# Altium project remoteV1.3.1.PrjPcb
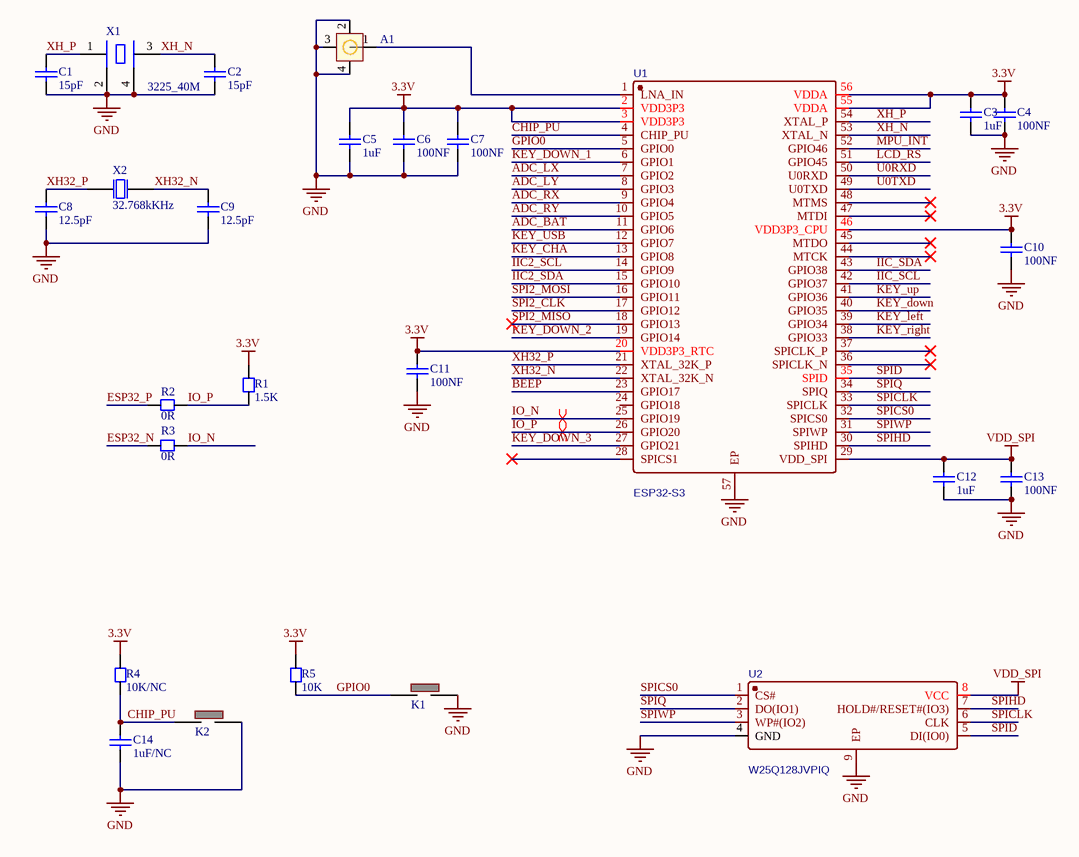
[diagram p0: Sheet0-mcu.SchDoc]
5 sheets, 195 parts. Net scope: global (net labels, ports and power ports of the same name join across sheets).
Board file: PCB.PcbDoc
Sheets:
  Sheet0-mcu.SchDoc
  Sheet1-control.SchDoc
  Sheet2-USB.SchDoc
  connect_board.SchDoc
  recv_board.SchDoc

## Sheet Sheet0-mcu.SchDoc
size A4; SheetNumber: 1; SheetTotal: 5

### Parts
A1  ANT-IPEX  [IPEX-SMD_HC-RF-IPEX0303-01]  (value not drawn)
C1  15pF  [CC1608-0603]
C2  15pF  [CC1608-0603]
C3  1uF  [CC1608-0603]
C4  100NF  [CC1608-0603]
C5  1uF  [CC1608-0603]
C6  100NF  [CC1608-0603]
C7  100NF  [CC1608-0603]
C8  12.5pF  [CC1608-0603]
C9  12.5pF  [CC1608-0603]
C10  100NF  [CC1608-0603]
C11  100NF  [CC1608-0603]
C12  1uF  [CC1608-0603]
C13  100NF  [CC1608-0603]
C14  1uF/NC  [CC1608-0603]
K1  KEY 3*4  [KEY 3*4]  (value not drawn)
K2  KEY 3*4  [KEY 3*4]  (value not drawn)
R1  1.5K  [CR1608-0603]
R2  0R  [CR1608-0603]
R3  0R  [CR1608-0603]
R4  10K/NC  [CR1608-0603]
R5  10K  [CR1608-0603]
U1  ESP32-S3  [QFN-56]
U2  W25Q128JVPIQ  [WSON-8]
X1  3225_40M  [XTAL-3225]
X2  32.768kKHz  [XTAL-3215]

### Nets
3.3V: C3.2 C4.2 C5.2 C6.2 C7.2 C10.2 C11.2 R1.1 R4.2 R5.2 U1.2(VDD3P3) U1.3(VDD3P3) U1.20(VDD3P3_RTC) U1.46(VDD3P3_CPU) U1.55(VDDA) U1.56(VDDA)
GND: A1.2 A1.3 A1.4 C1.1 C2.1 C3.1 C4.1 C5.1 C6.1 C7.1 C8.1 C9.1 C10.1 C11.1 C12.1 C13.1 C14.1 K1.2 K2.2 U1.57(EP) U2.4(GND) U2.9(EP) X1.2(GND) X1.4(GND)
VDD_SPI: C12.2 C13.2 U1.29(VDD_SPI) U2.8(VCC)
ADC_BAT: U1.11(GPIO6)
ADC_LX: U1.7(GPIO2)
ADC_LY: U1.8(GPIO3)
ADC_RX: U1.9(GPIO4)
ADC_RY: U1.10(GPIO5)
BEEP: U1.23(GPIO17)
CHIP_PU: C14.2 K2.1 R4.1 U1.4(CHIP_PU)
ESP32_N: R3.2
ESP32_P: R2.2
GPIO0: K1.1 R5.1 U1.5(GPIO0)
IIC2_SCL: U1.14(GPIO9)
IIC2_SDA: U1.15(GPIO10)
IIC_SCL: U1.42(GPIO37)
IIC_SDA: U1.43(GPIO38)
IO_N: R3.1 U1.25(GPIO19)
IO_P: R1.2 R2.1 U1.26(GPIO20)
KEY_CHA: U1.13(GPIO8)
KEY_down: U1.40(GPIO35)  [project net KEY_b]
KEY_DOWN_1: U1.6(GPIO1)
KEY_DOWN_2: U1.19(GPIO14)
KEY_DOWN_3: U1.27(GPIO21)
KEY_left: U1.39(GPIO34)
KEY_right: U1.38(GPIO33)  [project net KET_y]
KEY_up: U1.41(GPIO36)  [project net KEY_a]
KEY_USB: U1.12(GPIO7)
LCD_RS: U1.51(GPIO45)
MPU_INT: U1.52(GPIO46)
SPI2_CLK: U1.17(GPIO12)
SPI2_MISO: U1.18(GPIO13)
SPI2_MOSI: U1.16(GPIO11)
SPICLK: U1.33(SPICLK) U2.6(CLK)
SPICS0: U1.32(SPICS0) U2.1(CS#)
SPID: U1.35(SPID) U2.5(DI(IO0))
SPIHD: U1.30(SPIHD) U2.7(HOLD#/RESET#(IO3))
SPIQ: U1.34(SPIQ) U2.2(DO(IO1))
SPIWP: U1.31(SPIWP) U2.3(WP#(IO2))
U0RXD: U1.50(U0RXD)
U0TXD: U1.49(U0TXD)
XH32_N: C9.2 U1.22(XTAL_32K_N) X2.2(OSC2)
XH32_P: C8.2 U1.21(XTAL_32K_P) X2.1(OSC1)
XH_N: C2.2 U1.53(XTAL_N) X1.3(OSC2)
XH_P: C1.2 U1.54(XTAL_P) X1.1(OSC1)
NetA1_1: A1.1 U1.1(LNA_IN)

Not connected (* = marked no-connect by the designer): U1 24(GPIO18) 28(SPICS1)* 36(SPICLK_N)* 37(SPICLK_P)* 44(MTCK)* 45(MTDO)* 47(MTDI)* 48(MTMS)*

### Layout directives
differential pair: IO_N, IO_P

### Library data of the parts
A1 = ANT-IPEX: 贴片封装的天线 封装类型为IPEX
C1-C14 = Cap Chip 0603: 0603封装的电容; Published: 8-Jun-2000; Revision: July-2002: Re-released for DXP Platform.; Publisher: Altium Limited
K1 K2 = KEY 3*4: 轻触开关按键
R1-R5 = Resistor Chip 0603: 0603封装电阻; Published: 8-Jun-2000; Revision: July-2002: Re-released for DXP Platform.; Publisher: Altium Limited
U1 = ESP32-S3: Manufacturer: ESPRESSIF(乐鑫); Contributor: LCSC; Supplier: LCSC; Supplier Part: C2913192; Manufacturer Part: ESP32-S3; JLCPCB Part Class: Extended Part; spicePre: U; spiceSymbolName: ESP32-S3
U2 = W25Q128JVPIQ: Manufacturer: WINBOND(华邦); Contributor: LCSC; Supplier: LCSC; Supplier Part: C2803379; Manufacturer Part: W25Q128JVPIQ; JLCPCB Part Class: Extended Part; spicePre: U; spiceSymbolName: W25Q128JVPIQ
X1 = XTAL 3225: 3225封装的晶振
X2 = XTAL 3215 32.768kKHz: 3215封装的时钟晶振

## Sheet Sheet1-control.SchDoc
size A3; SheetNumber: 2; SheetTotal: 5
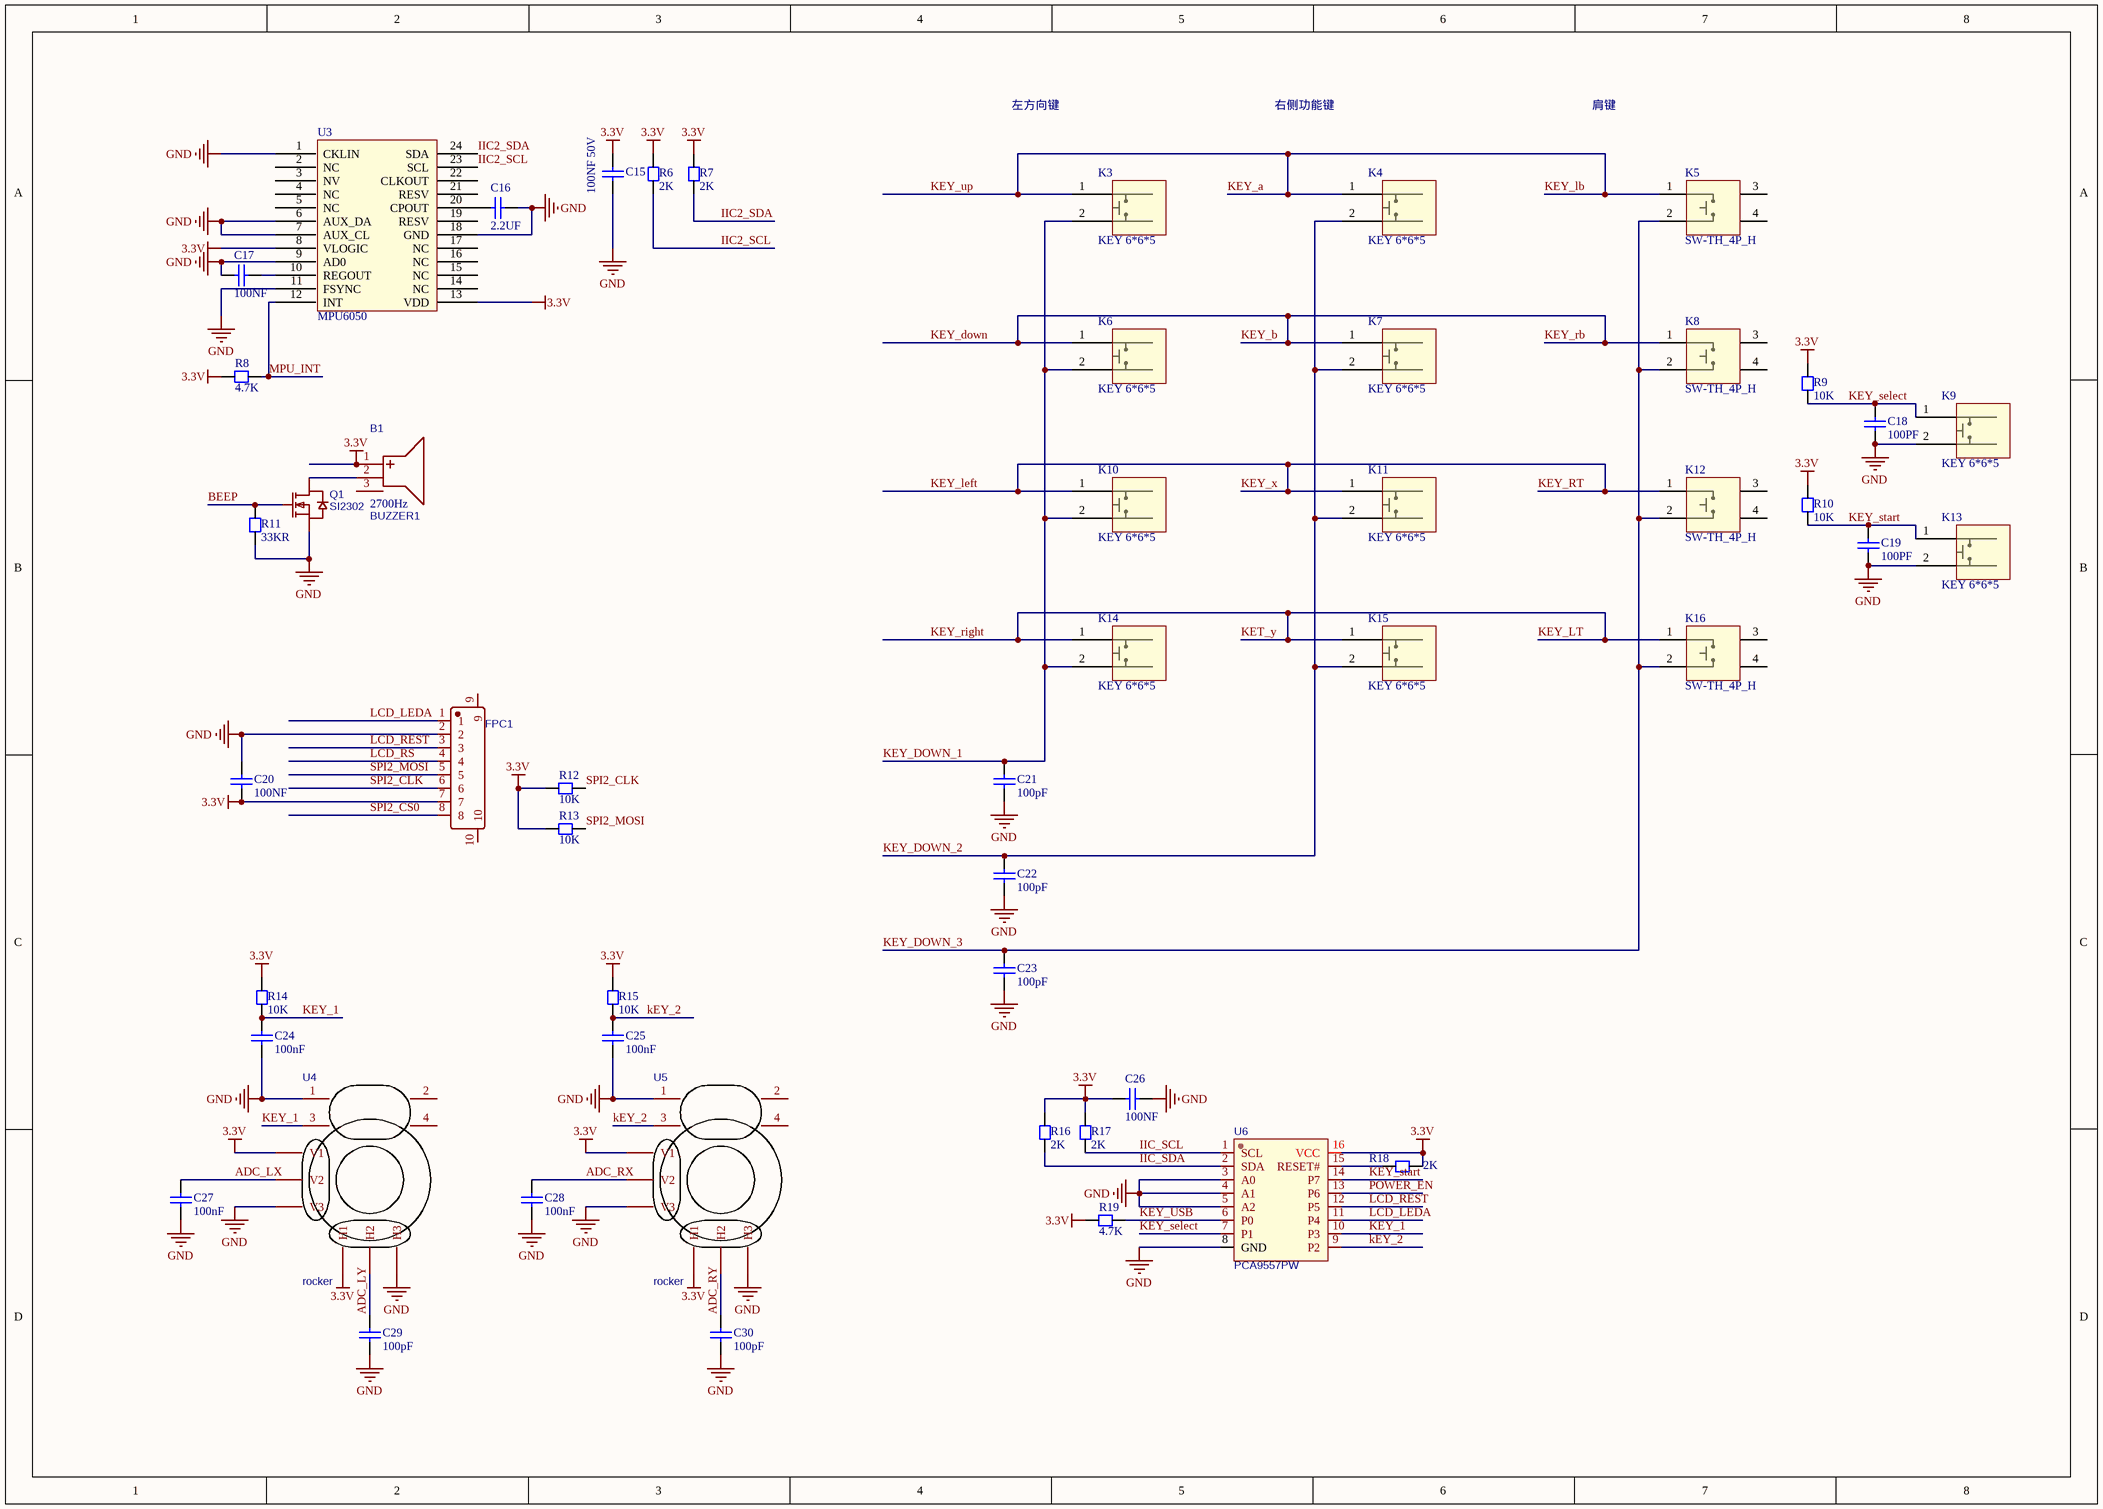
[diagram p1: Sheet1-control.SchDoc]

### Parts
B1  BUZZER1  [BUZ-SMD_GSC7525RA]
C15  100NF 50V  [CC1608-0603]
C16  2.2UF  [CC1608-0603]
C17  100NF  [CC1608-0603]
C18  100PF  [CC1608-0603]
C19  100PF  [CC1608-0603]
C20  100NF  [CC1608-0603]
C21  100pF  [CC1608-0603]
C22  100pF  [CC1608-0603]
C23  100pF  [CC1608-0603]
C24  100nF  [CC1608-0603]
C25  100nF  [CC1608-0603]
C26  100NF  [CC1608-0603]
C27  100nF  [CC1608-0603]
C28  100nF  [CC1608-0603]
C29  100pF  [CC1608-0603]
C30  100pF  [CC1608-0603]
FPC1  FFC 05 8P  [FFC-SMD_8P-P0.50]  (value not drawn)
K3  KEY 6*6*5  [KEY 6*6*5]
K4  KEY 6*6*5  [KEY 6*6*5]
K5  SW-TH_4P_H  [SW-TH_KH-6X6X7H-ZJ]
K6  KEY 6*6*5  [KEY 6*6*5]
K7  KEY 6*6*5  [KEY 6*6*5]
K8  SW-TH_4P_H  [SW-TH_KH-6X6X7H-ZJ]
K9  KEY 6*6*5  [KEY 6*6*5]
K10  KEY 6*6*5  [KEY 6*6*5]
K11  KEY 6*6*5  [KEY 6*6*5]
K12  SW-TH_4P_H  [SW-TH_KH-6X6X7H-ZJ]
K13  KEY 6*6*5  [KEY 6*6*5]
K14  KEY 6*6*5  [KEY 6*6*5]
K15  KEY 6*6*5  [KEY 6*6*5]
K16  SW-TH_4P_H  [SW-TH_KH-6X6X7H-ZJ]
Q1  SI2302  [SOT-23]
R6  2K  [CR1608-0603]
R7  2K  [CR1608-0603]
R8  4.7K  [CR1608-0603]
R9  10K  [CR1608-0603]
R10  10K  [CR1608-0603]
R11  33KR  [CR1608-0603]
R12  10K  [CR1608-0603]
R13  10K  [CR1608-0603]
R14  10K  [CR1608-0603]
R15  10K  [CR1608-0603]
R16  2K  [CR1608-0603]
R17  2K  [CR1608-0603]
R18  2K  [CR1608-0603]
R19  4.7K  [CR1608-0603]
U3  MPU6050  [QFN24 - duplicate]
U4  rocker  [PCBComponent_1]
U5  rocker  [PCBComponent_1]
U6  PCA9557PW  [TSSOP-16]

### Nets
3.3V: B1.1(+) C15.2 C20.1 C26.2 FPC1.7 R6.1 R7.1 R8.1 R9.1 R10.1 R12.2 R13.2 R14.2 R15.2 R16.1 R17.1 R18.1 R19.1 U3.8(VLOGIC) U3.13(VDD) U4.5(V1) U4.8(H1) U5.5(V1) U5.8(H1) U6.16(VCC)
GND: C15.1 C16.2 C17.1 C18.2 C19.2 C20.2 C21.1 C22.1 C23.1 C24.1 C25.1 C26.1 C27.1 C28.1 C29.1 C30.1 FPC1.2 K9.2 K13.2 Q1.2(S) R11.2 U3.1(CKLIN) U3.6(AUX_DA) U3.7(AUX_CL) U3.9(AD0) U3.11(FSYNC) U3.18(GND) U4.1 U4.7(V3) U4.10(H3) U5.1 U5.7(V3) U5.10(H3) U6.3(A0) U6.4(A1) U6.5(A2) U6.8(GND)
ADC_LX: C27.2 U4.6(V2)
ADC_LY: C29.2 U4.9(H2)
ADC_RX: C28.2 U5.6(V2)
ADC_RY: C30.2 U5.9(H2)
BEEP: Q1.1(G) R11.1
IIC2_SCL: R6.2 U3.23(SCL)
IIC2_SDA: R7.2 U3.24(SDA)
IIC_SCL: R17.2 U6.1(SCL)
IIC_SDA: R16.2 U6.2(SDA)
KET_y: K14.1 K15.1 K16.1  [also labelled KEY_LT, KEY_right]
KEY_1: C24.2 R14.1 U4.3 U6.10(P3)
kEY_2: C25.2 R15.1 U5.3 U6.9(P2)
KEY_a: K3.1 K4.1 K5.1  [also labelled KEY_lb, KEY_up]
KEY_b: K6.1 K7.1 K8.1  [also labelled KEY_down, KEY_rb]
KEY_DOWN_1: C21.2 K3.2 K6.2 K10.2 K14.2
KEY_DOWN_2: C22.2 K4.2 K7.2 K11.2 K15.2
KEY_DOWN_3: C23.2 K5.2 K8.2 K12.2 K16.2
KEY_left: K10.1 K11.1 K12.1  [also labelled KEY_RT, KEY_x]
KEY_select: C18.1 K9.1 R9.2 U6.7(P1)
KEY_start: C19.1 K13.1 R10.2 U6.14(P7)
KEY_USB: R19.2 U6.6(P0)
LCD_LEDA: FPC1.1 U6.11(P4)
LCD_REST: FPC1.3 U6.12(P5)
LCD_RS: FPC1.4
MPU_INT: R8.2 U3.12(INT)
POWER_EN: U6.13(P6)
SPI2_CLK: FPC1.6 R12.1
SPI2_CS0: FPC1.8
SPI2_MOSI: FPC1.5 R13.1
NetB1_2: B1.2(-) Q1.3(D)
NetC16_1: C16.1 U3.20(CPOUT)
NetC17_2: C17.2 U3.10(REGOUT)
NetR18_2: R18.2 U6.15(RESET#)

Not connected (* = marked no-connect by the designer): B1 3(EH); FPC1 9 10; K5 3 4; K8 3 4; K12 3 4; K16 3 4; U3 2(NC) 3(NV) 4(NC) 5(NC) 14(NC) 15(NC) 16(NC) 17(NC) 19(RESV) 21(RESV) 22(CLKOUT); U4 2 4; U5 2 4

### Notes on the sheet
- 左方向键
- 右侧功能键
- 肩键

### Library data of the parts
B1 = BUZZER1: 2700Hz; Manufacturer: INGHAi(赢海); Manufacturer Part: GSC7525RA-16R2700; Contributor: LCSC; nameAlias: Value; Supplier: LCSC; Supplier Part: C255313; spicePre: B; spiceSymbolName: GSC7525RA-16R2700
C15-C30 = Cap Chip 0603: 0603封装的电容; Published: 8-Jun-2000; Revision: July-2002: Re-released for DXP Platform.; Publisher: Altium Limited
FPC1 = FFC 05 8P: Manufacturer: TXGA(特思嘉); Manufacturer Part: FFC05001-08SBB124W5M-H; Contributor: LCSC; Supplier: LCSC; Supplier Part: C456420; JLCPCB Part Class: Extended Part; spicePre: F; spiceSymbolName: FFC05001-08SBB124W5M-H
K3 K4 K6 K7 K9-K11 K13-K15 = KEY 6*6*5: 无声轻触开关
K5 K8 K12 K16 = SW-TH_4P_H: 卧式轻触开关
Q1 = SI2302: N沟道 / 漏源电压(Vdss) 20V / 连续漏极电流(Id) 2.8A / 功率(Pd) 900mW / 导通电阻(RDS(on)@Vgs,Id) 55mΩ@4.5V,2.8A / 阈值电压(Vgs(th)@Id) 1.2V@250uA / 输入电容(Ciss@Vds) 260pF@10V; Manufacturer: TWGMC(台湾迪嘉); Manufacturer Part: SI2306; Contributor: LCSC; Supplier: LCSC; Supplier Part: C727154; JLCPCB Part Class: Extended Part; spicePre: Q; spiceSymbolName: SI2306_C727154
R6-R10 R12-R19 = Resistor Chip 0603: 0603封装电阻; Published: 8-Jun-2000; Revision: July-2002: Re-released for DXP Platform.; Publisher: Altium Limited
R11 = Chip resistor: 贴片电阻
U3 = MPU6050: 陀螺仪
U4 U5 = rocker: Manufacturer Part: 摇杆; Contributor: Alex_Ai; spicePre: U; spiceSymbolName: 摇杆_直插_圆半径13_10电气脚_4固定脚 COPY
U6 = PCA9557PW: TSSOP-16 8位I2C总线和SMBus I/O扩展器芯片; Manufacturer: TI(德州仪器); Contributor: LCSC; Supplier: LCSC; Supplier Part: C1542488; Manufacturer Part: PCA9557PW; JLCPCB Part Class: Extended Part; spicePre: U; spiceSymbolName: PCA9557PW

## Sheet Sheet2-USB.SchDoc
size A3; SheetNumber: 3; SheetTotal: 5
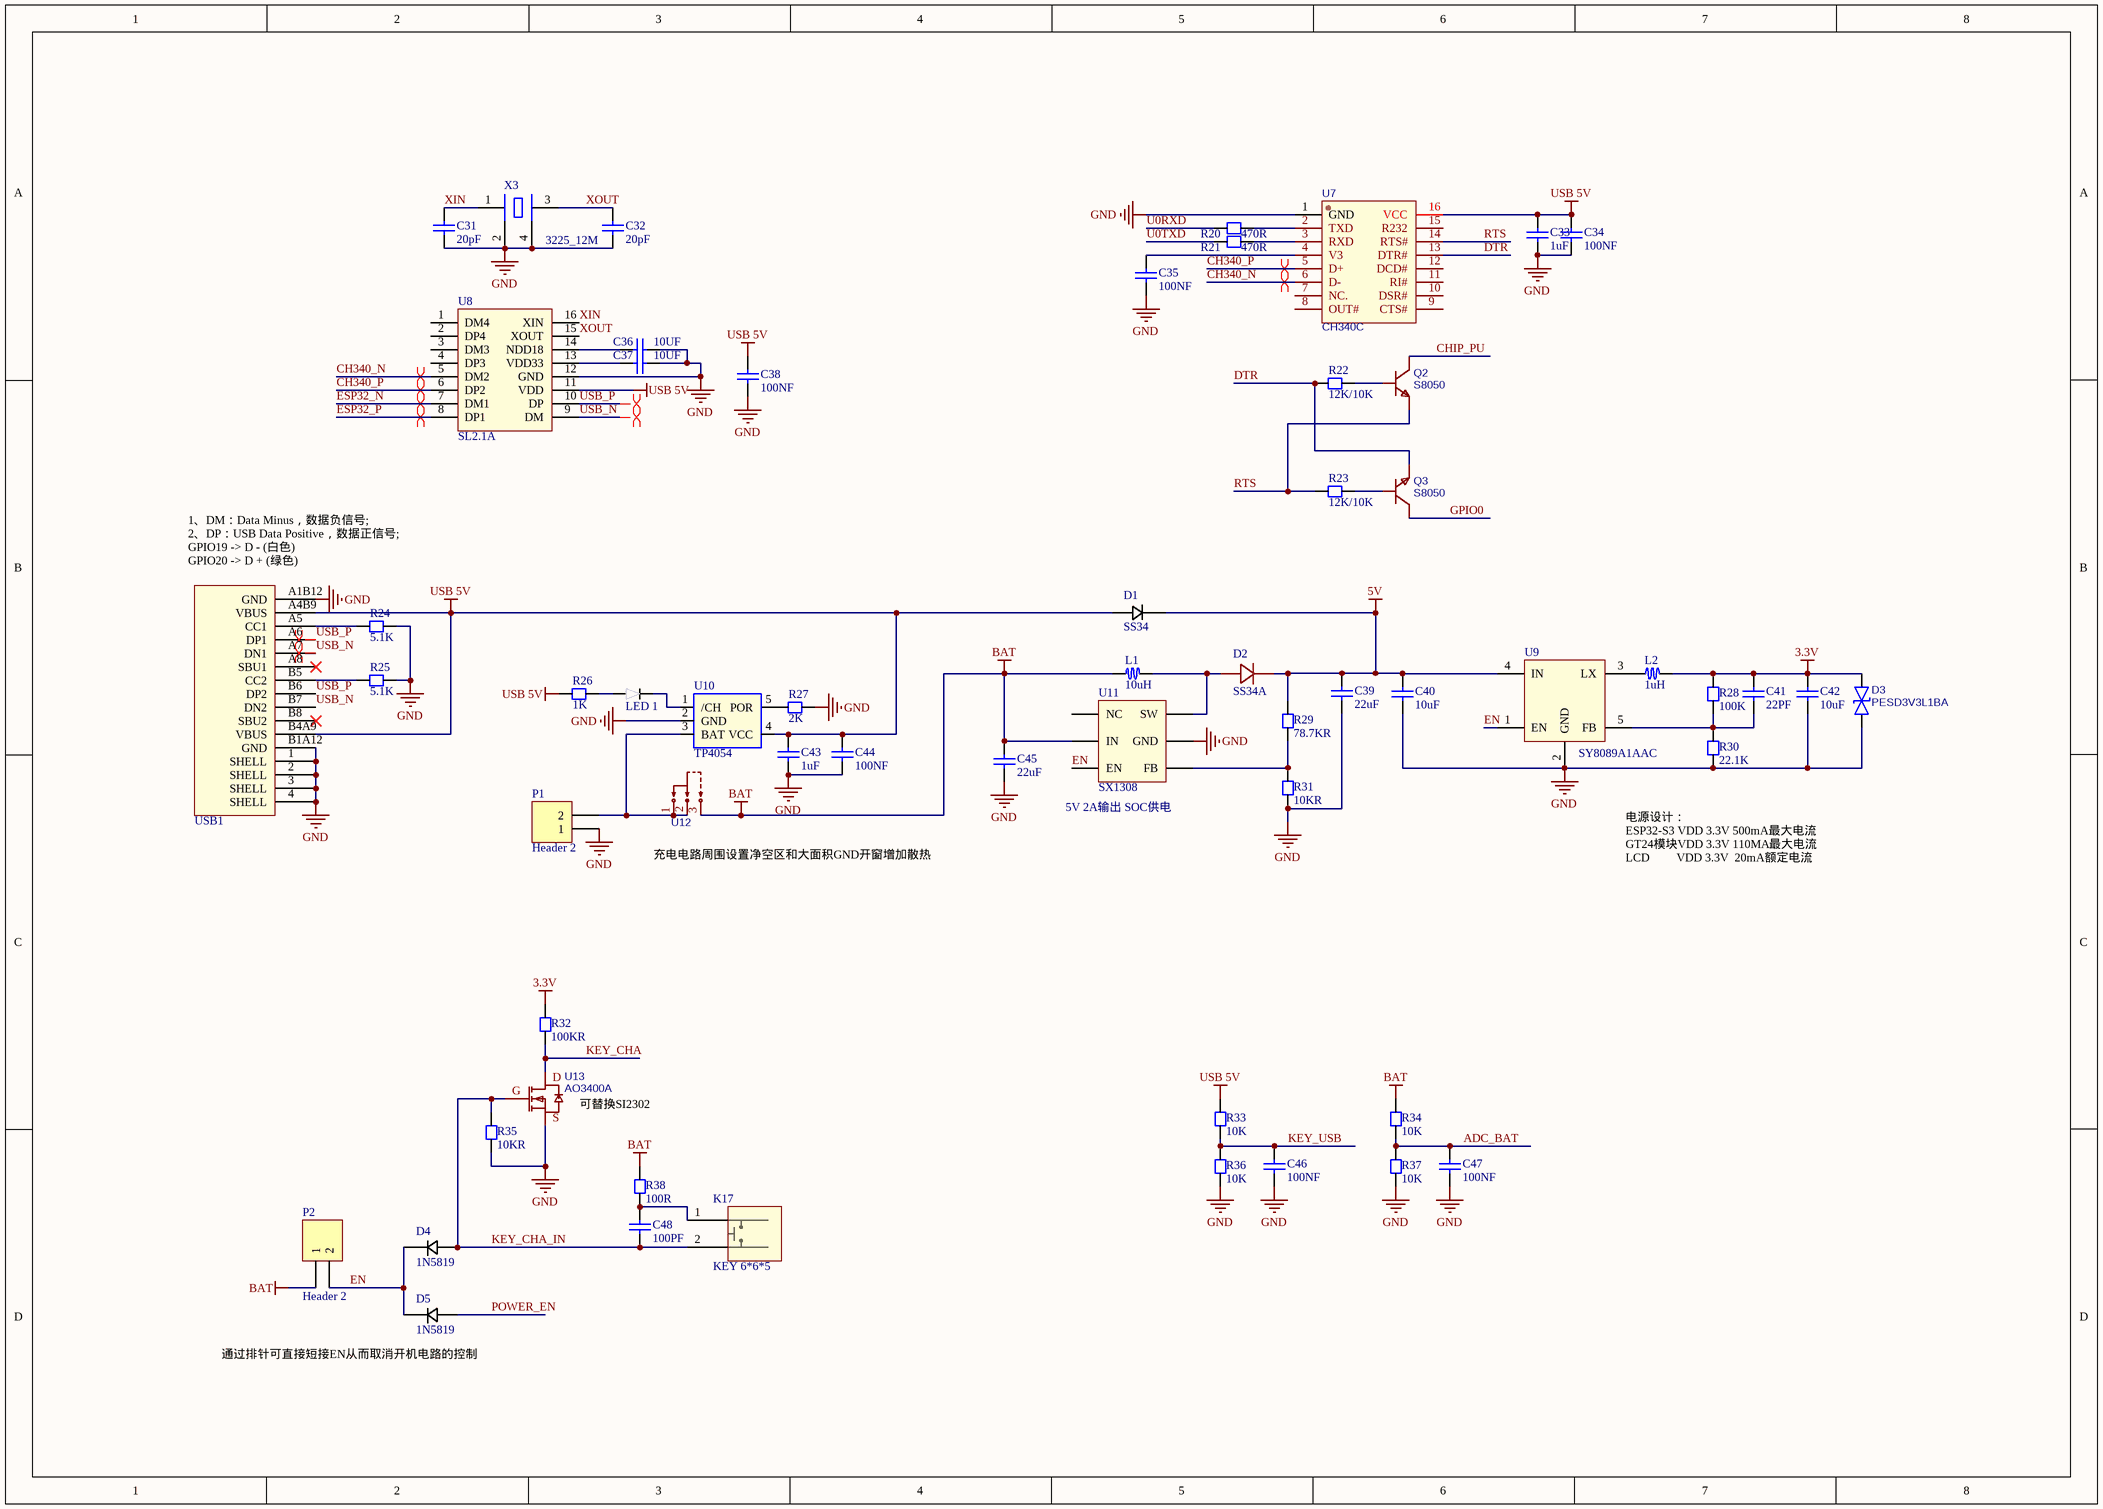
[diagram p2: Sheet2-USB.SchDoc]

### Parts
C31  20pF  [CC1608-0603]
C32  20pF  [CC1608-0603]
C33  1uF  [CC1608-0603]
C34  100NF  [CC1608-0603]
C35  100NF  [CC1608-0603]
C36  10UF  [CC1608-0603]
C37  10UF  [CC1608-0603]
C38  100NF  [CC1608-0603]
C39  22uF  [CC1608-0603]
C40  10uF  [CC1608-0603]
C41  22PF  [CC1608-0603]
C42  10uF  [CC1608-0603]
C43  1uF  [CC1608-0603]
C44  100NF  [CC1608-0603]
C45  22uF  [CC1608-0603]
C46  100NF  [CC1608-0603]
C47  100NF  [CC1608-0603]
C48  100PF  [CC1608-0603]
D1  SS34  [DO-214 AA]
D2  SS34A  [DO-214 AA SMB]
D3  PESD3V3L1BA  [SOD-323]
D4  1N5819  [SOD-323_L1.8-W1.3-LS2.5-RD]
D5  1N5819  [SOD-323_L1.8-W1.3-LS2.5-RD]
K17  KEY 6*6*5  [KEY 6*6*5]
L1  10uH  [Inductor-6045]
L2  1uH  [Inductor-4018]
LED_1  LED 0603  [LED 0603]  (value not drawn)
P1  Header 2  [HX2.54-2]
P2  Header 2  [HDR1X2]
Q2  S8050  [SOT-23]
Q3  S8050  [SOT-23]
R20  470R  [CR1608-0603]
R21  470R  [CR1608-0603]
R22  12K/10K  [CR1608-0603]
R23  12K/10K  [CR1608-0603]
R24  5.1K  [CR1608-0603]
R25  5.1K  [CR1608-0603]
R26  1K  [CR1608-0603]
R27  2K  [CR1608-0603]
R28  100K  [CR1608-0603]
R29  78.7KR  [CR1608-0603]
R30  22.1K  [CR1608-0603]
R31  10KR  [CR1608-0603]
R32  100KR  [CR1608-0603]
R33  10K  [CR1608-0603]
R34  10K  [CR1608-0603]
R35  10KR  [CR1608-0603]
R36  10K  [CR1608-0603]
R37  10K  [CR1608-0603]
R38  100R  [CR1608-0603]
U7  CH340C  [SOP-16]
U8  SL2.1A  [SOP-16]
U9  SY8089A1AAC  [SOT23-5]
U10  TP4054  [SOT23-5]
U11  SX1308  [SOT23-6]
U12  HX SS12D10G4  [SW-TH_3P-SS12D06]  (value not drawn)
U13  AO3400A  [SOT-23]
USB1  Tpye-c 16P  [TYPE-C 16P]  (value not drawn)
X3  3225_12M  [XTAL-3225]

### Nets
3.3V: C41.2 C42.2 D3.1 L2.2 R28.1 R32.2
5V: C39.1 C40.2 D1.1(K) D2.1(C) R29.2 U9.4(IN)
BAT: C45.2 L1.1 P2.1 R34.2 R38.1 U11.5(IN) U12.3
GND: C31.1 C32.1 C33.1 C34.1 C35.1 C36.1 C37.1 C38.1 C39.2 C40.1 C42.1 C43.1 C44.1 C45.1 C46.1 C47.1 D3.2 P1.1 R24.1 R25.1 R27.2 R30.2 R31.1 R35.1 R36.1 R37.1 U7.1(GND) U8.12(GND) U9.2(GND) U10.2(GND) U11.2(GND) U13.2(S) USB1.1(SHELL) USB1.2(SHELL) USB1.3(SHELL) USB1.4(SHELL) USB1.A1B12(GND) USB1.B1A12(GND) X3.2(GND) X3.4(GND)
USB 5V: C33.2 C34.2 C38.2 C43.2 C44.2 D1.2(A) R26.1 R33.2 U7.16(VCC) U8.11(VDD) U10.4(VCC) USB1.A4B9(VBUS) USB1.B4A9(VBUS)
ADC_BAT: C47.2 R34.1 R37.2
CH340_N: U7.6(D-) U8.5(DM2)
CH340_P: U7.5(D+) U8.6(DP2)
CHIP_PU: Q2.3(C)
DTR: Q3.2(E) R22.1 U7.13(DTR#)
EN: D4.1 D5.1 P2.2 U9.1(EN) U11.4(EN)
ESP32_N: U8.7(DM1)
ESP32_P: U8.8(DP1)
GPIO0: Q3.3(C)
KEY_CHA: R32.1 U13.3(D)
KEY_CHA_IN: C48.2 D4.2 K17.2 R35.2 U13.1(G)
KEY_USB: C46.2 R33.1 R36.2
POWER_EN: D5.2
RTS: Q2.2(E) R23.1 U7.14(RTS#)
U0RXD: R20.2
U0TXD: R21.2
USB_N: U8.9(DM) USB1.A7(DN1) USB1.B7(DN2)
USB_P: U8.10(DP) USB1.A6(DP1) USB1.B6(DP2)
XIN: C31.2 U8.16(XIN) X3.1(OSC1)
XOUT: C32.2 U8.15(XOUT) X3.3(OSC2)
NetC35_2: C35.2 U7.4(V3)
NetC36_2: C36.2 U8.14(NDD18)
NetC37_2: C37.2 U8.13(VDD33)
NetC41_1: C41.1 R28.2 R30.1 U9.5(FB)
NetC48_1: C48.1 K17.1 R38.2
NetD2_2: D2.2(A) L1.2 U11.1(SW)
NetL2_1: L2.1 U9.3(LX)
NetLED_1_1: LED_1.1 R26.2
NetLED_1_2: LED_1.2 U10.1(/CH)
NetP1_2: P1.2 U10.3(BAT) U12.1 U12.2
NetQ2_1: Q2.1(B) R22.2
NetQ3_1: Q3.1(B) R23.2
NetR20_1: R20.1 U7.2(TXD)
NetR21_1: R21.1 U7.3(RXD)
NetR24_2: R24.2 USB1.A5(CC1)
NetR25_2: R25.2 USB1.B5(CC2)
NetR27_1: R27.1 U10.5(POR)
NetR29_1: R29.1 R31.2 U11.3(FB)

Not connected (* = marked no-connect by the designer): U7 7(NC.) 8(OUT#) 9(CTS#) 10(DSR#) 11(RI#) 12(DCD#) 15(R232); U8 1(DM4) 2(DP4) 3(DM3) 4(DP3); U11 6(NC); USB1 A8(SBU1)* B8(SBU2)*

### Layout directives
differential pair: CH340_N, CH340_P, ESP32_N, ESP32_P, USB_N, USB_P

### Notes on the sheet
- (near USB1) 1、DM：Data Minus，数据负信号;
  2、DP：USB Data Positive，数据正信号;
  GPIO19 -> D - (白色)
  GPIO20 -> D + (绿色)
- (near U12) 充电电路周围设置净空区和大面积GND开窗增加散热
- (near U11) 5V 2A输出 SOC供电
- 电源设计：
  ESP32-S3 VDD 3.3V 500mA最大电流
  GT24模块VDD 3.3V 110MA最大电流
  LCD         VDD 3.3V  20mA额定电流
- (near U13) 可替换SI2302
- 通过排针可直接短接EN从而取消开机电路的控制

### Library data of the parts
C31-C38 C40-C48 = Cap Chip 0603: 0603封装的电容; Published: 8-Jun-2000; Revision: July-2002: Re-released for DXP Platform.; Publisher: Altium Limited
C39 = Chip capacitor: 贴片电容
D1 = SS34: 肖特基二极管
D2 = SS34A: 大电流肖特基二极管，5A/40V
D3 = PESD3V3L1BA: SOD-323 3.3V 双向ESD防静电二极管保护芯片; Manufacturer: MDD; Manufacturer Part: SMAJ6.5CA; Supplier: LCSC; Supplier Part: C110041; JLCPCB Part Class: Extended Part; spicePre: D; spiceSymbolName: SMAJ6.5CA-C110041
D4 D5 = 1N5819: 肖特基二极管
K17 = KEY 6*6*5: 无声轻触开关
L1 = Inductor-6045: 6045封装 线绕SMD功率电感
L2 = Inductor-4018: 贴片电感 1206封装
P1 P2 = Header 2: Header, 2-Pin; LatestRevisionDate: 17-Jul-2002; LatestRevisionNote: Re-released for DXP Platform.; Publisher: Altium Limited
Q2 Q3 = S8050: Manufacturer: SALLTECH(萨瑞); Contributor: lcsc; Supplier: LCSC; Supplier Part: C3027096; Manufacturer Part: S8050; spicePre: Q; spiceSymbolName: S8050_C3027096
R20-R28 R30 R33 R34 R36-R38 = Resistor Chip 0603: 0603封装电阻; Published: 8-Jun-2000; Revision: July-2002: Re-released for DXP Platform.; Publisher: Altium Limited
R29 R31 R32 R35 = Chip resistor: 贴片电阻
U7 = CH340C: Manufacturer: WCH(南京沁恒); Supplier: LCSC; Manufacturer Part: CH340C; Supplier Part: C84681; JLCPCB Part Class: Extended Part; spicePre: U; spiceSymbolName: CH340C
U8 = SL2.1A: USB HUB 四拓展
U9 = SY8089A1AAC: SY8089A1是一种高效率的1.5MHz同步降压DC/DC稳压器，能够提供高达输出电流2A。它可以在2.5V到5.5V的宽输入电压范围内工作，集成了主开关和同步开关，具有极低的RDS(ON)，最大限度地减少了导通损耗。 / 输出电压纹波小，外接电感小，电容器尺寸小 / 1.5MHz开关频率。
U10 = TP4054: 迷你充电IC SOT-23-5
U11 = SX1308: SOT23-6 升压芯片
U12 = SW-TH_3P-SS12D06: BOM_Manufacturer: hanxia(韩下); Contributor: lcsc; BOM_Supplier: LCSC; BOM_Supplier Part: C5149841; BOM_Manufacturer Part: HX SS12D10G4; link: https://atta.szlcsc.com/upload/public/pdf/source/20220907/2020D7183ED16DD6E2B9F5A13FB144CF.pdf; BOM_JLCPCB Part Class: Extended Part; spicePre: U; spiceSymbolName: HX SS12D10G4
U13 = AO3400A: UMW AO3400A SOT-23 30V/5.8A N沟道 MOS(场效应管)芯片; Manufacturer: ElecSuper(静芯微）; Manufacturer Part: AO3401A; Contributor: lcsc; Supplier: LCSC; Supplier Part: C5224202; JLCPCB Part Class: Extended Part; link: https://so.szlcsc.com/global.html?k=C5224202&ref=editor; spicePre: U; spiceSymbolName: AO3401A_C5224202
USB1 = Tpye-c 16P: 16P 封装的TYPE -c接口 4固定插脚 双向
X3 = XTAL 3225: 3225封装的晶振

## Sheet connect_board.SchDoc
size A3; SheetNumber: 4; SheetTotal: 5
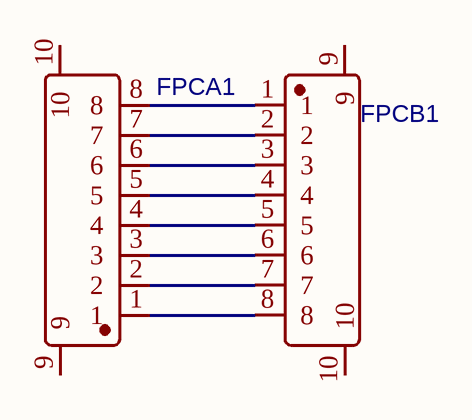
[diagram p3: connect_board.SchDoc]

### Parts
FPCA1  FFC 05 8P  [FFC-SMD_8P-P0.50]  (value not drawn)
FPCB1  FFC 05 8P  [FFC-SMD_8P-P0.50]  (value not drawn)

### Nets
NetFPCA1_1: FPCA1.1 FPCB1.8
NetFPCA1_2: FPCA1.2 FPCB1.7
NetFPCA1_3: FPCA1.3 FPCB1.6
NetFPCA1_4: FPCA1.4 FPCB1.5
NetFPCA1_5: FPCA1.5 FPCB1.4
NetFPCA1_6: FPCA1.6 FPCB1.3
NetFPCA1_7: FPCA1.7 FPCB1.2
NetFPCA1_8: FPCA1.8 FPCB1.1

Not connected (* = marked no-connect by the designer): FPCA1 9 10; FPCB1 9 10

### Library data of the parts
FPCA1 FPCB1 = FFC 05 8P: as FPC1 on sheet Sheet1-control; Supplier: LCSC; Supplier Part: C456420; JLCPCB Part Class: Extended Part; spicePre: F; spiceSymbolName: FFC05001-08SBB124W5M-H

## Sheet recv_board.SchDoc
size A3; SheetNumber: 5; SheetTotal: 5
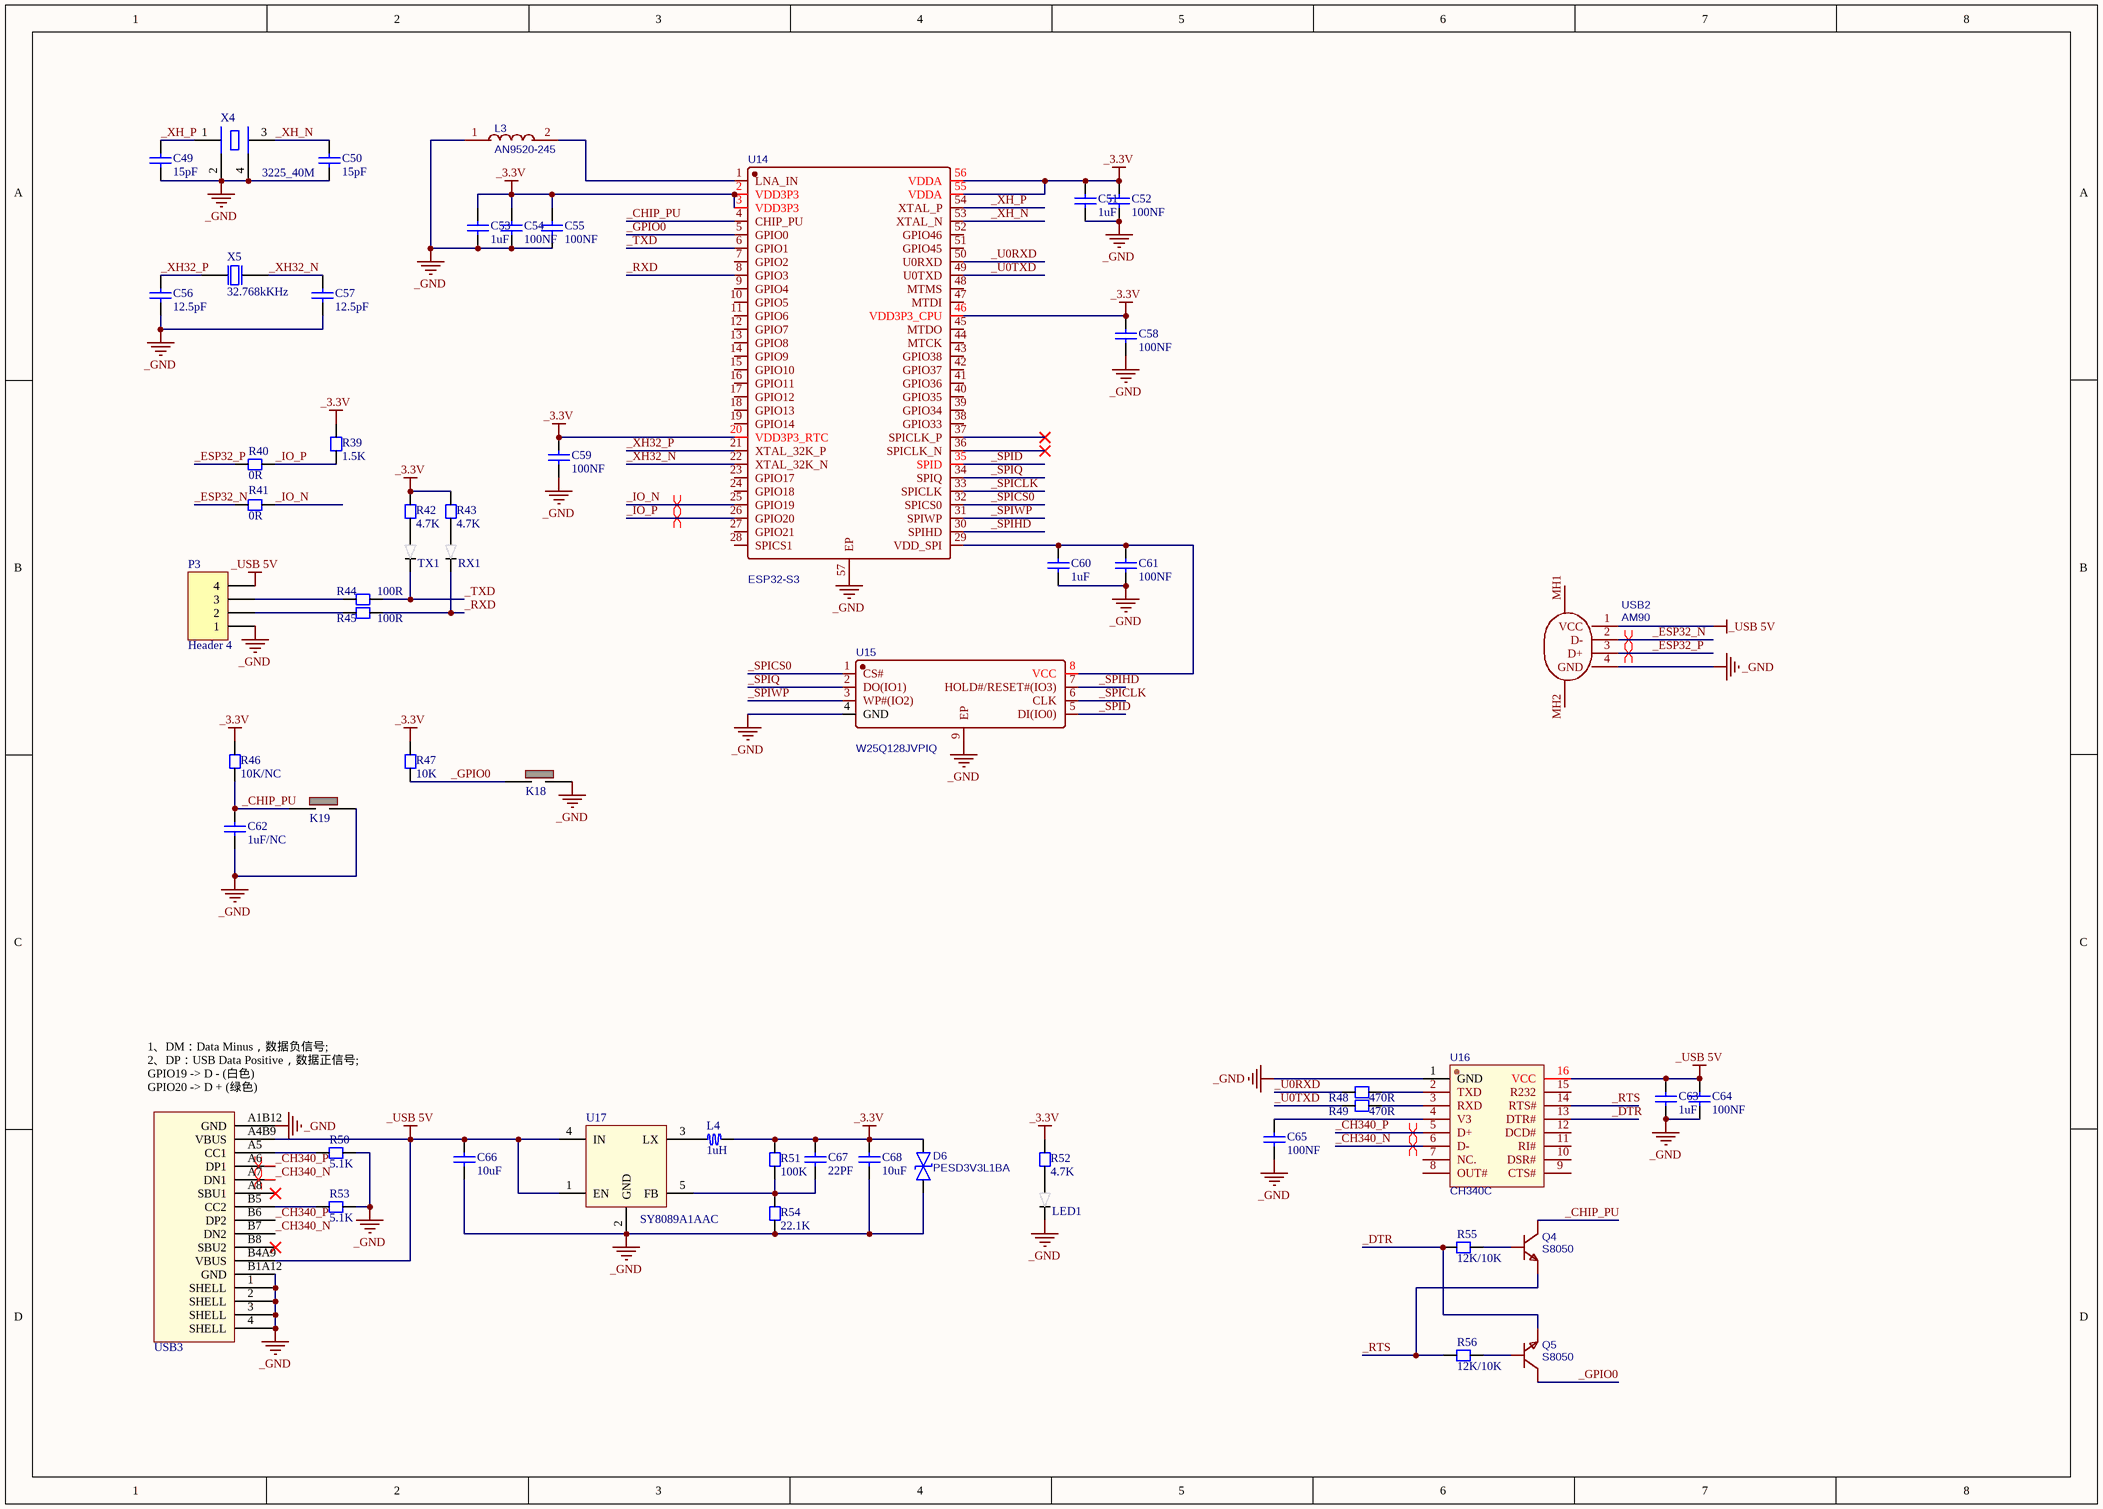
[diagram p4: recv_board.SchDoc]

### Parts
C49  15pF  [CC1608-0603]
C50  15pF  [CC1608-0603]
C51  1uF  [CC1608-0603]
C52  100NF  [CC1608-0603]
C53  1uF  [CC1608-0603]
C54  100NF  [CC1608-0603]
C55  100NF  [CC1608-0603]
C56  12.5pF  [CC1608-0603]
C57  12.5pF  [CC1608-0603]
C58  100NF  [CC1608-0603]
C59  100NF  [CC1608-0603]
C60  1uF  [CC1608-0603]
C61  100NF  [CC1608-0603]
C62  1uF/NC  [CC1608-0603]
C63  1uF  [CC1608-0603]
C64  100NF  [CC1608-0603]
C65  100NF  [CC1608-0603]
C66  10uF  [CC1608-0603]
C67  22PF  [CC1608-0603]
C68  10uF  [CC1608-0603]
D6  PESD3V3L1BA  [SOD-323]
K18  KEY 3*4  [KEY 3*4]  (value not drawn)
K19  KEY 3*4  [KEY 3*4]  (value not drawn)
L3  AN9520-245  [ANT-SMD_L9.5-W2.1]
L4  1uH  [Inductor-4018]
LED1  LED 0603  [LED 0603]  (value not drawn)
P3  Header 4  [HDR1X4]
Q4  S8050  [SOT-23]
Q5  S8050  [SOT-23]
R39  1.5K  [CR1608-0603]
R40  0R  [CR1608-0603]
R41  0R  [CR1608-0603]
R42  4.7K  [CR1608-0603]
R43  4.7K  [CR1608-0603]
R44  100R  [CR1608-0603]
R45  100R  [CR1608-0603]
R46  10K/NC  [CR1608-0603]
R47  10K  [CR1608-0603]
R48  470R  [CR1608-0603]
R49  470R  [CR1608-0603]
R50  5.1K  [CR1608-0603]
R51  100K  [CR1608-0603]
R52  4.7K  [CR1608-0603]
R53  5.1K  [CR1608-0603]
R54  22.1K  [CR1608-0603]
R55  12K/10K  [CR1608-0603]
R56  12K/10K  [CR1608-0603]
RX1  LED 0603  [LED 0603]  (value not drawn)
TX1  LED 0603  [LED 0603]  (value not drawn)
U14  ESP32-S3  [QFN-56]
U15  W25Q128JVPIQ  [WSON-8]
U16  CH340C  [SOP-16]
U17  SY8089A1AAC  [SOT23-5]
USB2  AM90  [USB-AM]
USB3  Tpye-c 16P  [TYPE-C 16P]  (value not drawn)
X4  3225_40M  [XTAL-3225]
X5  32.768kKHz  [XTAL-3215]

### Nets
_3.3V: C51.2 C52.2 C53.2 C54.2 C55.2 C58.2 C59.2 C67.2 C68.2 D6.1 L4.2 R39.1 R42.1 R43.1 R46.2 R47.2 R51.1 R52.1 U14.2(VDD3P3) U14.3(VDD3P3) U14.20(VDD3P3_RTC) U14.46(VDD3P3_CPU) U14.55(VDDA) U14.56(VDDA)
_GND: C49.1 C50.1 C51.1 C52.1 C53.1 C54.1 C55.1 C56.1 C57.1 C58.1 C59.1 C60.1 C61.1 C62.1 C63.1 C64.1 C65.1 C66.1 C68.1 D6.2 K18.2 K19.2 L3.1 LED1.2 P3.1 R50.1 R53.1 R54.2 U14.57(EP) U15.4(GND) U15.9(EP) U16.1(GND) U17.2(GND) USB2.4(GND) USB3.1(SHELL) USB3.2(SHELL) USB3.3(SHELL) USB3.4(SHELL) USB3.A1B12(GND) USB3.B1A12(GND) X4.2(GND) X4.4(GND)
_USB 5V: C63.2 C64.2 C66.2 P3.4 U16.16(VCC) U17.1(EN) U17.4(IN) USB2.1(VCC) USB3.A4B9(VBUS) USB3.B4A9(VBUS)
_CH340_N: U16.6(D-) USB3.A7(DN1) USB3.B7(DN2)
_CH340_P: U16.5(D+) USB3.A6(DP1) USB3.B6(DP2)
_CHIP_PU: C62.2 K19.1 Q4.3(C) R46.1 U14.4(CHIP_PU)
_DTR: Q5.2(E) R55.1 U16.13(DTR#)
_ESP32_N: R41.2 USB2.2(D-)
_ESP32_P: R40.2 USB2.3(D+)
_GPIO0: K18.1 Q5.3(C) R47.1 U14.5(GPIO0)
_IO_N: R41.1 U14.25(GPIO19)
_IO_P: R39.2 R40.1 U14.26(GPIO20)
_RTS: Q4.2(E) R56.1 U16.14(RTS#)
_RXD: R45.1 RX1.2 U14.8(GPIO3)
_SPICLK: U14.33(SPICLK) U15.6(CLK)
_SPICS0: U14.32(SPICS0) U15.1(CS#)
_SPID: U14.35(SPID) U15.5(DI(IO0))
_SPIHD: U14.30(SPIHD) U15.7(HOLD#/RESET#(IO3))
_SPIQ: U14.34(SPIQ) U15.2(DO(IO1))
_SPIWP: U14.31(SPIWP) U15.3(WP#(IO2))
_TXD: R44.1 TX1.2 U14.6(GPIO1)
_U0RXD: R48.2 U14.50(U0RXD)
_U0TXD: R49.2 U14.49(U0TXD)
_XH32_N: C57.2 U14.22(XTAL_32K_N) X5.2(OSC2)
_XH32_P: C56.2 U14.21(XTAL_32K_P) X5.1(OSC1)
_XH_N: C50.2 U14.53(XTAL_N) X4.3(OSC2)
_XH_P: C49.2 U14.54(XTAL_P) X4.1(OSC1)
NetC60_2: C60.2 C61.2 U14.29(VDD_SPI) U15.8(VCC)
NetC65_2: C65.2 U16.4(V3)
NetC67_1: C67.1 R51.2 R54.1 U17.5(FB)
NetL3_2: L3.2 U14.1(LNA_IN)
NetL4_1: L4.1 U17.3(LX)
NetLED1_1: LED1.1 R52.2
NetP3_2: P3.2 R45.2
NetP3_3: P3.3 R44.2
NetQ4_1: Q4.1(B) R55.2
NetQ5_1: Q5.1(B) R56.2
NetR42_2: R42.2 TX1.1
NetR43_2: R43.2 RX1.1
NetR48_1: R48.1 U16.2(TXD)
NetR49_1: R49.1 U16.3(RXD)
NetR50_2: R50.2 USB3.A5(CC1)
NetR53_2: R53.2 USB3.B5(CC2)

Not connected (* = marked no-connect by the designer): U14 7(GPIO2) 9(GPIO4) 10(GPIO5) 11(GPIO6) 12(GPIO7) 13(GPIO8) 14(GPIO9) 15(GPIO10) 16(GPIO11) 17(GPIO12) 18(GPIO13) 19(GPIO14) 23(GPIO17) 24(GPIO18) 27(GPIO21) 28(SPICS1) 36(SPICLK_N)* 37(SPICLK_P)* 38(GPIO33) 39(GPIO34) 40(GPIO35) 41(GPIO36) 42(GPIO37) 43(GPIO38) 44(MTCK) 45(MTDO) 47(MTDI) 48(MTMS) 51(GPIO45) 52(GPIO46); U16 7(NC.) 8(OUT#) 9(CTS#) 10(DSR#) 11(RI#) 12(DCD#) 15(R232); USB2 MH1 MH2; USB3 A8(SBU1)* B8(SBU2)*

### Layout directives
differential pair: _CH340_N, _CH340_P, _ESP32_N, _ESP32_P, _IO_N, _IO_P

### Notes on the sheet
- (near USB3) 1、DM：Data Minus，数据负信号;
  2、DP：USB Data Positive，数据正信号;
  GPIO19 -> D - (白色)
  GPIO20 -> D + (绿色)

### Library data of the parts
C49-C68 = Cap Chip 0603: 0603封装的电容; Published: 8-Jun-2000; Revision: July-2002: Re-released for DXP Platform.; Publisher: Altium Limited
D6 = PESD3V3L1BA: as D3 on sheet Sheet2-USB; Supplier: LCSC; Supplier Part: C110041; JLCPCB Part Class: Extended Part; spicePre: D; spiceSymbolName: SMAJ6.5CA-C110041
K18 K19 = KEY 3*4: 轻触开关按键
L3 = AN9520-245: Manufacturer: rainsun(霖昱微); Supplier: LCSC; Manufacturer Part: AN9520-245; Supplier Part: C99665; JLCPCB Part Class: Extended Part; spicePre: L; spiceSymbolName: AN9520-245
L4 = Inductor-4018: 贴片电感 1206封装
P3 = Header 4: Header, 4-Pin; LatestRevisionDate: 17-Jul-2002; LatestRevisionNote: Re-released for DXP Platform.; Publisher: Altium Limited
Q4 Q5 = S8050: as Q2 on sheet Sheet2-USB; Supplier: LCSC; Supplier Part: C3027096; Manufacturer Part: S8050; spicePre: Q; spiceSymbolName: S8050_C3027096
R39-R56 = Resistor Chip 0603: 0603封装电阻; Published: 8-Jun-2000; Revision: July-2002: Re-released for DXP Platform.; Publisher: Altium Limited
U14 = ESP32-S3: as U1 on sheet Sheet0-mcu; Supplier: LCSC; Supplier Part: C2913192; Manufacturer Part: ESP32-S3; JLCPCB Part Class: Extended Part; spicePre: U; spiceSymbolName: ESP32-S3
U15 = W25Q128JVPIQ: as U2 on sheet Sheet0-mcu; Supplier: LCSC; Supplier Part: C2803379; Manufacturer Part: W25Q128JVPIQ; JLCPCB Part Class: Extended Part; spicePre: U; spiceSymbolName: W25Q128JVPIQ
U16 = CH340C: Manufacturer: WCH(南京沁恒); Supplier: LCSC; Manufacturer Part: CH340C; Supplier Part: C84681; JLCPCB Part Class: Extended Part; spicePre: U; spiceSymbolName: CH340C
U17 = SY8089A1AAC: as U9 on sheet Sheet2-USB
USB2 = USB-AM90: Manufacturer: SHOU HAN(首韩); Contributor: LCSC; Supplier: LCSC; Supplier Part: C404965; Manufacturer Part: AM90; JLCPCB Part Class: Extended Part; spicePre: U; spiceSymbolName: AM90
USB3 = Tpye-c 16P: 16P 封装的TYPE -c接口 4固定插脚 双向
X4 = XTAL 3225: 3225封装的晶振
X5 = XTAL 3215 32.768kKHz: 3215封装的时钟晶振

## Nets that join several sheets
3.3V: Sheet0-mcu (16 pins), Sheet1-control (25 pins), Sheet2-USB (6 pins)
GND: Sheet0-mcu (24 pins), Sheet1-control (37 pins), Sheet2-USB (40 pins)
ADC_BAT: Sheet0-mcu (U1.11), Sheet2-USB (C47.2 R34.1 R37.2)
ADC_LX: Sheet0-mcu (U1.7), Sheet1-control (C27.2 U4.6)
ADC_LY: Sheet0-mcu (U1.8), Sheet1-control (C29.2 U4.9)
ADC_RX: Sheet0-mcu (U1.9), Sheet1-control (C28.2 U5.6)
ADC_RY: Sheet0-mcu (U1.10), Sheet1-control (C30.2 U5.9)
BEEP: Sheet0-mcu (U1.23), Sheet1-control (Q1.1 R11.1)
CHIP_PU: Sheet0-mcu (C14.2 K2.1 R4.1 U1.4), Sheet2-USB (Q2.3)
ESP32_N: Sheet0-mcu (R3.2), Sheet2-USB (U8.7)
ESP32_P: Sheet0-mcu (R2.2), Sheet2-USB (U8.8)
GPIO0: Sheet0-mcu (K1.1 R5.1 U1.5), Sheet2-USB (Q3.3)
IIC2_SCL: Sheet0-mcu (U1.14), Sheet1-control (R6.2 U3.23)
IIC2_SDA: Sheet0-mcu (U1.15), Sheet1-control (R7.2 U3.24)
IIC_SCL: Sheet0-mcu (U1.42), Sheet1-control (R17.2 U6.1)
IIC_SDA: Sheet0-mcu (U1.43), Sheet1-control (R16.2 U6.2)
KET_y: Sheet0-mcu (U1.38), Sheet1-control (K14.1 K15.1 K16.1)
KEY_a: Sheet0-mcu (U1.41), Sheet1-control (K3.1 K4.1 K5.1)
KEY_b: Sheet0-mcu (U1.40), Sheet1-control (K6.1 K7.1 K8.1)
KEY_CHA: Sheet0-mcu (U1.13), Sheet2-USB (R32.1 U13.3)
KEY_DOWN_1: Sheet0-mcu (U1.6), Sheet1-control (5 pins)
KEY_DOWN_2: Sheet0-mcu (U1.19), Sheet1-control (5 pins)
KEY_DOWN_3: Sheet0-mcu (U1.27), Sheet1-control (5 pins)
KEY_left: Sheet0-mcu (U1.39), Sheet1-control (K10.1 K11.1 K12.1)
KEY_USB: Sheet0-mcu (U1.12), Sheet1-control (R19.2 U6.6), Sheet2-USB (C46.2 R33.1 R36.2)
LCD_RS: Sheet0-mcu (U1.51), Sheet1-control (FPC1.4)
MPU_INT: Sheet0-mcu (U1.52), Sheet1-control (R8.2 U3.12)
POWER_EN: Sheet1-control (U6.13), Sheet2-USB (D5.2)
SPI2_CLK: Sheet0-mcu (U1.17), Sheet1-control (FPC1.6 R12.1)
SPI2_MOSI: Sheet0-mcu (U1.16), Sheet1-control (FPC1.5 R13.1)
U0RXD: Sheet0-mcu (U1.50), Sheet2-USB (R20.2)
U0TXD: Sheet0-mcu (U1.49), Sheet2-USB (R21.2)